# Altium schematic sheet 05_IO_CONN.SchDoc: IO CONN
size A4; Date: 20/11/2014; Author: HuangRui <vowstar@gmail.com>; DrawnBy: JiYaping <jyp1817@gmail.com>; Organization: WWW.NODEMCU.COM
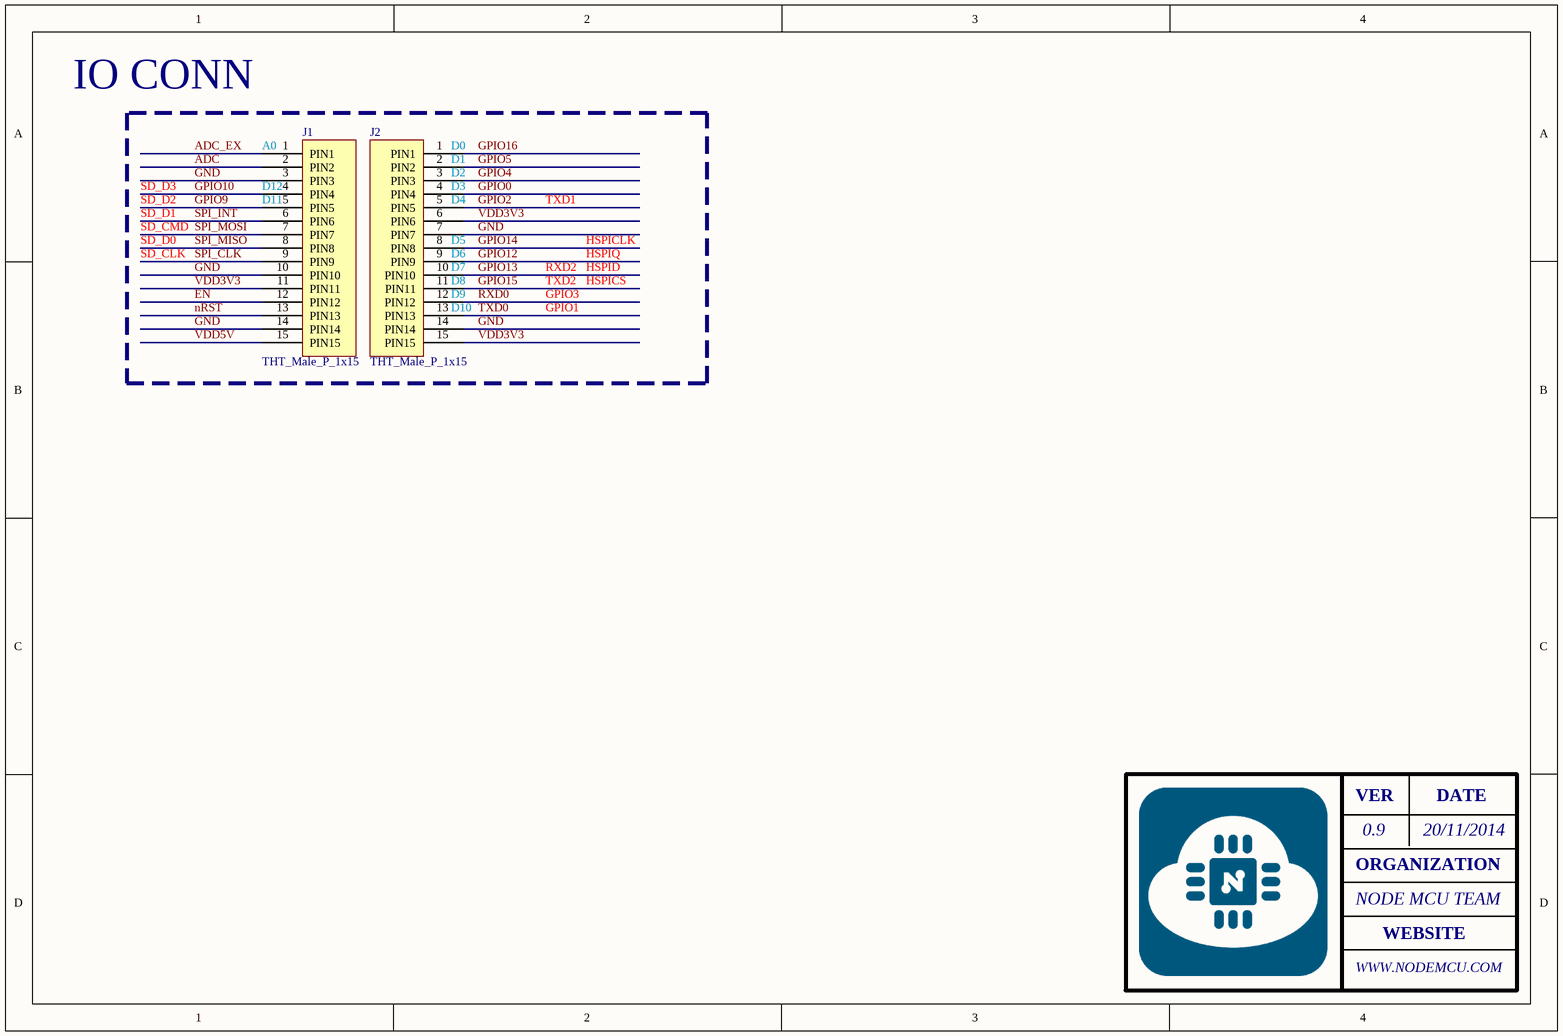
[diagram p0: 05_IO_CONN.SchDoc]

## Parts
J1  THT_Male_P_1x15  [THT_Male_P_1x15-2.54mm]
J2  THT_Male_P_1x15  [THT_Male_P_1x15-2.54mm]

## Nets
ADC: J1.2(PIN2)
ADC_EX: J1.1(PIN1)
EN: J1.12(PIN12)
GND: J1.3(PIN3) J1.10(PIN10) J1.14(PIN14) J2.7(PIN7) J2.14(PIN14)
GPIO0: J2.4(PIN4)
GPIO2: J2.5(PIN5)
GPIO4: J2.3(PIN3)
GPIO5: J2.2(PIN2)
GPIO9: J1.5(PIN5)
GPIO10: J1.4(PIN4)
GPIO12: J2.9(PIN9)
GPIO13: J2.10(PIN10)
GPIO14: J2.8(PIN8)
GPIO15: J2.11(PIN11)
GPIO16: J2.1(PIN1)
nRST: J1.13(PIN13)
RXD0: J2.12(PIN12)
SPI_CLK: J1.9(PIN9)
SPI_INT: J1.6(PIN6)
SPI_MISO: J1.8(PIN8)
SPI_MOSI: J1.7(PIN7)
TXD0: J2.13(PIN13)
VDD3V3: J1.11(PIN11) J2.6(PIN6) J2.15(PIN15)
VDD5V: J1.15(PIN15)

## Notes on the sheet
- (near J1) A0
- (near J2) D0
- (near J2) D1
- (near J2) D2
- SD_D0
- SD_CMD
- SD_D1
- SD_D3
- SD_D2
- (near J1) D12
- (near J1) D11
- (near J2) D3
- (near J2) D4
- (near J2) D5
- TXD1
- HSPICLK
- SD_CLK
- (near J2) D6
- (near J2) D7
- (near J2) D8
- (near J2) D9
- (near J2) D10
- TXD2
- RXD2
- GPIO3
- GPIO1
- HSPIQ
- HSPID
- HSPICS
- VER
- 0.9
- DATE
- ORGANIZATION
- NODE MCU TEAM
- WEBSITE

## Library data of the parts
J1 J2 = THT_Male_P_1x15: THT Male pin header strip 1x15